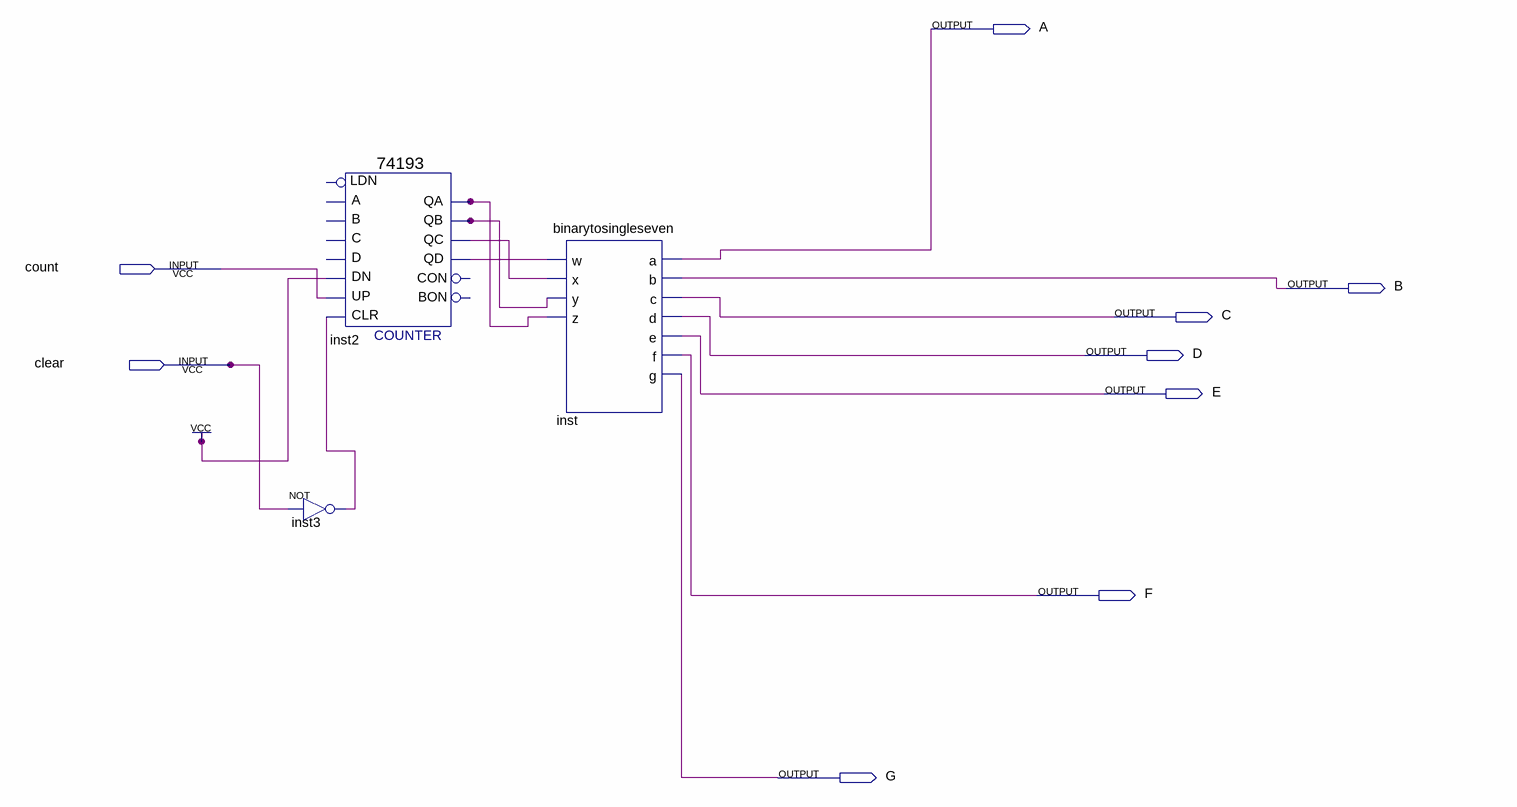
[diagram p0: schematic sheet]
// Quartus schematic fourtosevenblock.bdf as structural Verilog: 3 symbols, 9 pins
module fourtosevenblock (
  input  count,
  input  clear,
  output A,
  output B,
  output C,
  output D,
  output E,
  output F,
  output G
);

  wire inst2_qa, inst2_qb, inst2_qc, inst2_qd, inst3_out;

  not inst3 (inst3_out, clear);
  \74193  inst2 (
    .CLR(inst3_out), .UP(count), .DN(1'b1), .QB(inst2_qb), .QA(inst2_qa), .QD(inst2_qd), .QC(inst2_qc));  // open: D, C, B, A, LDN, CON, BON
  binarytosingleseven inst (
    .w(inst2_qd), .x(inst2_qc), .y(inst2_qb), .z(inst2_qa), .a(A), .b(B), .c(C), .d(D), .e(E), .f(F), .g(G));
endmodule
